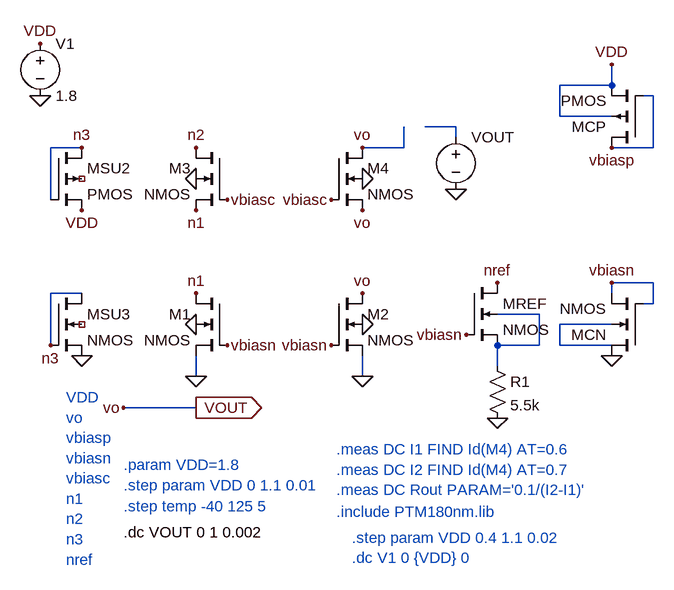
[diagram p0: schematic Draft1 (2).asc]
Draft1 (2).asc, the LTspice schematic file:
Version 4.1
SHEET 1 1468 680
WIRE 912 -256 912 -288
WIRE 912 -256 832 -256
WIRE 976 -240 960 -240
WIRE 832 -208 832 -256
WIRE 912 -208 832 -208
WIRE 672 -192 624 -192
WIRE 672 -176 672 -192
WIRE 96 -160 48 -160
WIRE 592 -160 592 -192
WIRE 592 -160 528 -160
WIRE 976 -160 976 -240
WIRE 976 -160 912 -160
WIRE 48 -80 48 -160
WIRE 976 48 912 48
WIRE 96 64 48 64
WIRE 912 64 912 48
WIRE 976 80 976 48
WIRE 976 80 960 80
WIRE 800 96 736 96
WIRE 912 112 832 112
WIRE 48 144 48 64
WIRE 800 144 800 96
WIRE 800 144 736 144
WIRE 832 144 832 112
WIRE 912 144 832 144
WIRE 736 176 736 144
WIRE 272 192 272 160
WIRE 528 192 528 160
WIRE 272 240 160 240
FLAG 912 -288 VDD
FLAG 912 160 0
FLAG 736 256 0
FLAG 736 48 nref
FLAG 912 -160 vbiasp
FLAG 912 48 vbiasn
FLAG 688 128 vbiasn
FLAG 32 -240 0
FLAG 528 192 0
FLAG 272 192 0
FLAG 272 64 n1
FLAG 528 64 vo
FLAG 320 -80 vbiasc
FLAG 528 -64 vo
FLAG 480 -80 vbiasc
FLAG 272 -64 n1
FLAG 320 144 vbiasn
FLAG 480 144 vbiasn
FLAG 272 -160 n2
FLAG 528 -160 vo
FLAG 32 -320 VDD
FLAG 96 -64 VDD
FLAG 96 160 0
FLAG 96 -160 n3
FLAG 528 -112 0
FLAG 272 -112 0
FLAG 272 112 0
FLAG 528 112 0
FLAG 48 144 n3
FLAG 160 240 vo
FLAG 272 240 VOUT
IOPIN 272 240 Out
FLAG 672 -96 0
SYMBOL voltage 32 -336 R0
WINDOW 123 0 0 Left 0
WINDOW 39 0 0 Left 0
SYMATTR InstName V1
SYMATTR Value 1.8
SYMBOL pmos4 960 -160 R180
SYMATTR InstName MCP
SYMATTR Value2 l=100u w=100u
SYMBOL nmos4 960 160 R180
SYMATTR InstName MCN
SYMATTR Value2 l=100u w=100u
SYMBOL res 720 160 R0
SYMATTR InstName R1
SYMATTR Value 5.5k
SYMBOL nmos4 688 48 R0
SYMATTR InstName MREF
SYMATTR Value2 l=2u w=200u
SYMBOL nmos4 320 64 M0
SYMATTR InstName M1
SYMATTR Value2 l=2u w=50u
SYMBOL nmos4 480 64 R0
SYMATTR InstName M2
SYMATTR Value2 l=2u w=50u
SYMBOL nmos4 320 -160 M0
SYMATTR InstName M3
SYMATTR Value2 l=2u w=50u
SYMBOL nmos4 480 -160 R0
SYMATTR InstName M4
SYMATTR Value2 l=2u w=50u
SYMBOL pmos4 48 -160 R0
SYMATTR InstName MSU2
SYMATTR Value2 l=20u w=10u
SYMBOL nmos4 48 64 R0
SYMATTR InstName MSU3
SYMATTR Value2 l=1u w=10u
SYMBOL voltage 672 -192 R0
SYMATTR InstName VOUT
SYMATTR Value ""
TEXT 488 400 Left 2 ;.include PTM180nm.lib
TEXT 72 224 Left 2 ;VDD\nvo\nvbiasp\nvbiasn\nvbiasc\nn1\nn2\nn3\nnref
TEXT 160 328 Left 2 ;.param VDD=1.8\n.step param VDD 0 1.1 0.01
TEXT 488 304 Left 2 ;.meas DC I1 FIND Id(M4) AT=0.6\n.meas DC I2 FIND Id(M4) AT=0.7\n.meas DC Rout PARAM='0.1/(I2-I1)'
TEXT 160 392 Left 2 ;.step temp -40 125 5
TEXT 160 432 Left 2 !.dc VOUT 0 1 0.002
TEXT 512 440 Left 2 ;.step param VDD 0.4 1.1 0.02\n.dc V1 0 {VDD} 0

The netlist it stands for:
* Draft1 (2).asc
V1 VDD 0 1.8
MCP vbiasp vbiasp VDD VDD PMOS l=100u w=100u
MCN 0 vbiasn vbiasn N003 NMOS l=100u w=100u
R1 N002 0 5.5k
MREF nref vbiasn N002 N002 NMOS l=2u w=200u
M1 n1 vbiasn 0 0 NMOS l=2u w=50u
M2 VOUT vbiasn 0 0 NMOS l=2u w=50u
M3 n2 vbiasc n1 0 NMOS l=2u w=50u
M4 VOUT vbiasc VOUT 0 NMOS l=2u w=50u
MSU2 n3 n3 VDD NC_01 PMOS l=20u w=10u
MSU3 n3 n3 0 NC_02 NMOS l=1u w=10u
VOUT N001 0
.model NMOS NMOS
.model PMOS PMOS
.lib standard.mos
* .include PTM180nm.lib
* VDD
* vo
* vbiasp
* vbiasn
* vbiasc
* n1
* n2
* n3
* nref
* .param VDD=1.8
* .step param VDD 0 1.1 0.01
* .meas DC I1 FIND Id(M4) AT=0.6
* .meas DC I2 FIND Id(M4) AT=0.7
* .meas DC Rout PARAM='0.1/(I2-I1)'
* .step temp -40 125 5
.dc VOUT 0 1 0.002
* .step param VDD 0.4 1.1 0.02
* .dc V1 0 {VDD} 0
.backanno
.end